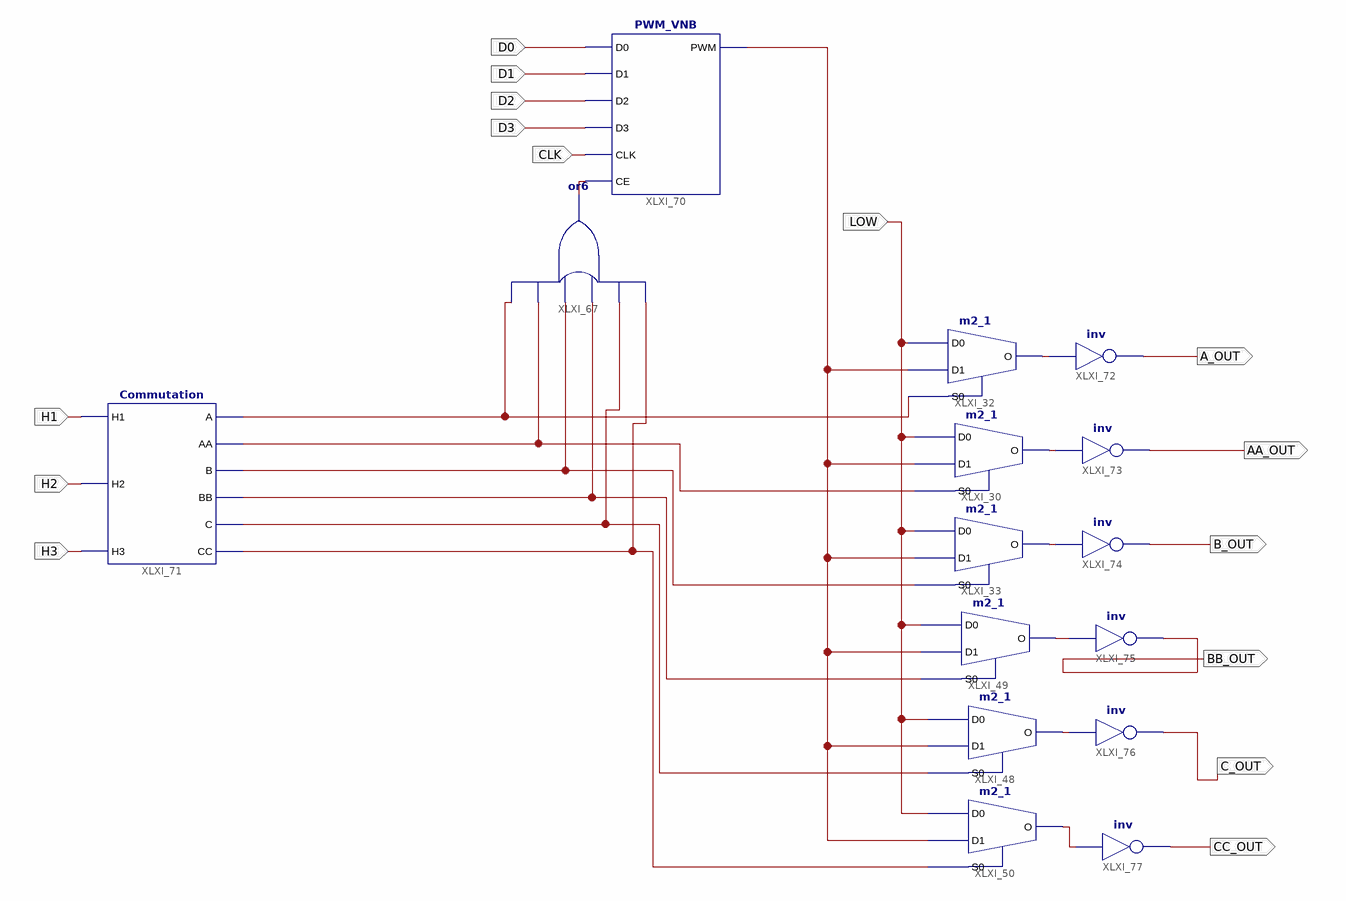
[diagram p0: schematic sheet 1]
// Xilinx ISE schematic main_sub.sch (spartan3e) as structural Verilog: 15 symbols, 15 ports
module main_sub (
  input  H3,
  input  H2,
  input  H1,
  input  LOW,
  input  D3,
  input  D2,
  input  D1,
  input  D0,
  input  CLK,
  output CC_OUT,
  output C_OUT,
  output BB_OUT,
  output B_OUT,
  output AA_OUT,
  output A_OUT
);

  wire XLXN_113, XLXN_114, XLXN_115, XLXN_116, XLXN_124, XLXN_128, XLXN_129, XLXN_130, XLXN_139;

  m2_1 XLXI_30 (.D0(LOW), .D1(XLXN_128), .S0(XLXN_130), .O(AA_OUT));
  m2_1 XLXI_32 (.D0(LOW), .D1(XLXN_128), .S0(XLXN_124), .O(A_OUT));
  m2_1 XLXI_33 (.D0(LOW), .D1(XLXN_128), .S0(XLXN_113), .O(B_OUT));
  m2_1 XLXI_49 (.D0(LOW), .D1(XLXN_128), .S0(XLXN_114), .O(XLXN_139));
  m2_1 XLXI_50 (.D0(LOW), .D1(XLXN_128), .S0(XLXN_116), .O(CC_OUT));
  m2_1 XLXI_48 (.D0(LOW), .D1(XLXN_128), .S0(XLXN_115), .O(C_OUT));
  or XLXI_67 (XLXN_129, XLXN_116, XLXN_115, XLXN_114, XLXN_113, XLXN_130, XLXN_124);
  PWM_VNB XLXI_70 (.D0(D0), .D1(D1), .D2(D2), .D3(D3), .CLK(CLK), .PWM(XLXN_128), .CE(XLXN_129));
  Commutation XLXI_71 (
    .H1(H1), .H2(H2), .H3(H3), .A(XLXN_124), .AA(XLXN_130), .B(XLXN_113), .BB(XLXN_114), .C(XLXN_115),
    .CC(XLXN_116));
  not XLXI_72 (A_OUT, A_OUT);
  not XLXI_73 (AA_OUT, AA_OUT);
  not XLXI_74 (B_OUT, B_OUT);
  not XLXI_75 (BB_OUT, XLXN_139);
  not XLXI_76 (C_OUT, C_OUT);
  not XLXI_77 (CC_OUT, CC_OUT);
endmodule
